# EAGLE schematic TP-34 (EAGLE 6.6.0)

## Sheet 1 of 4
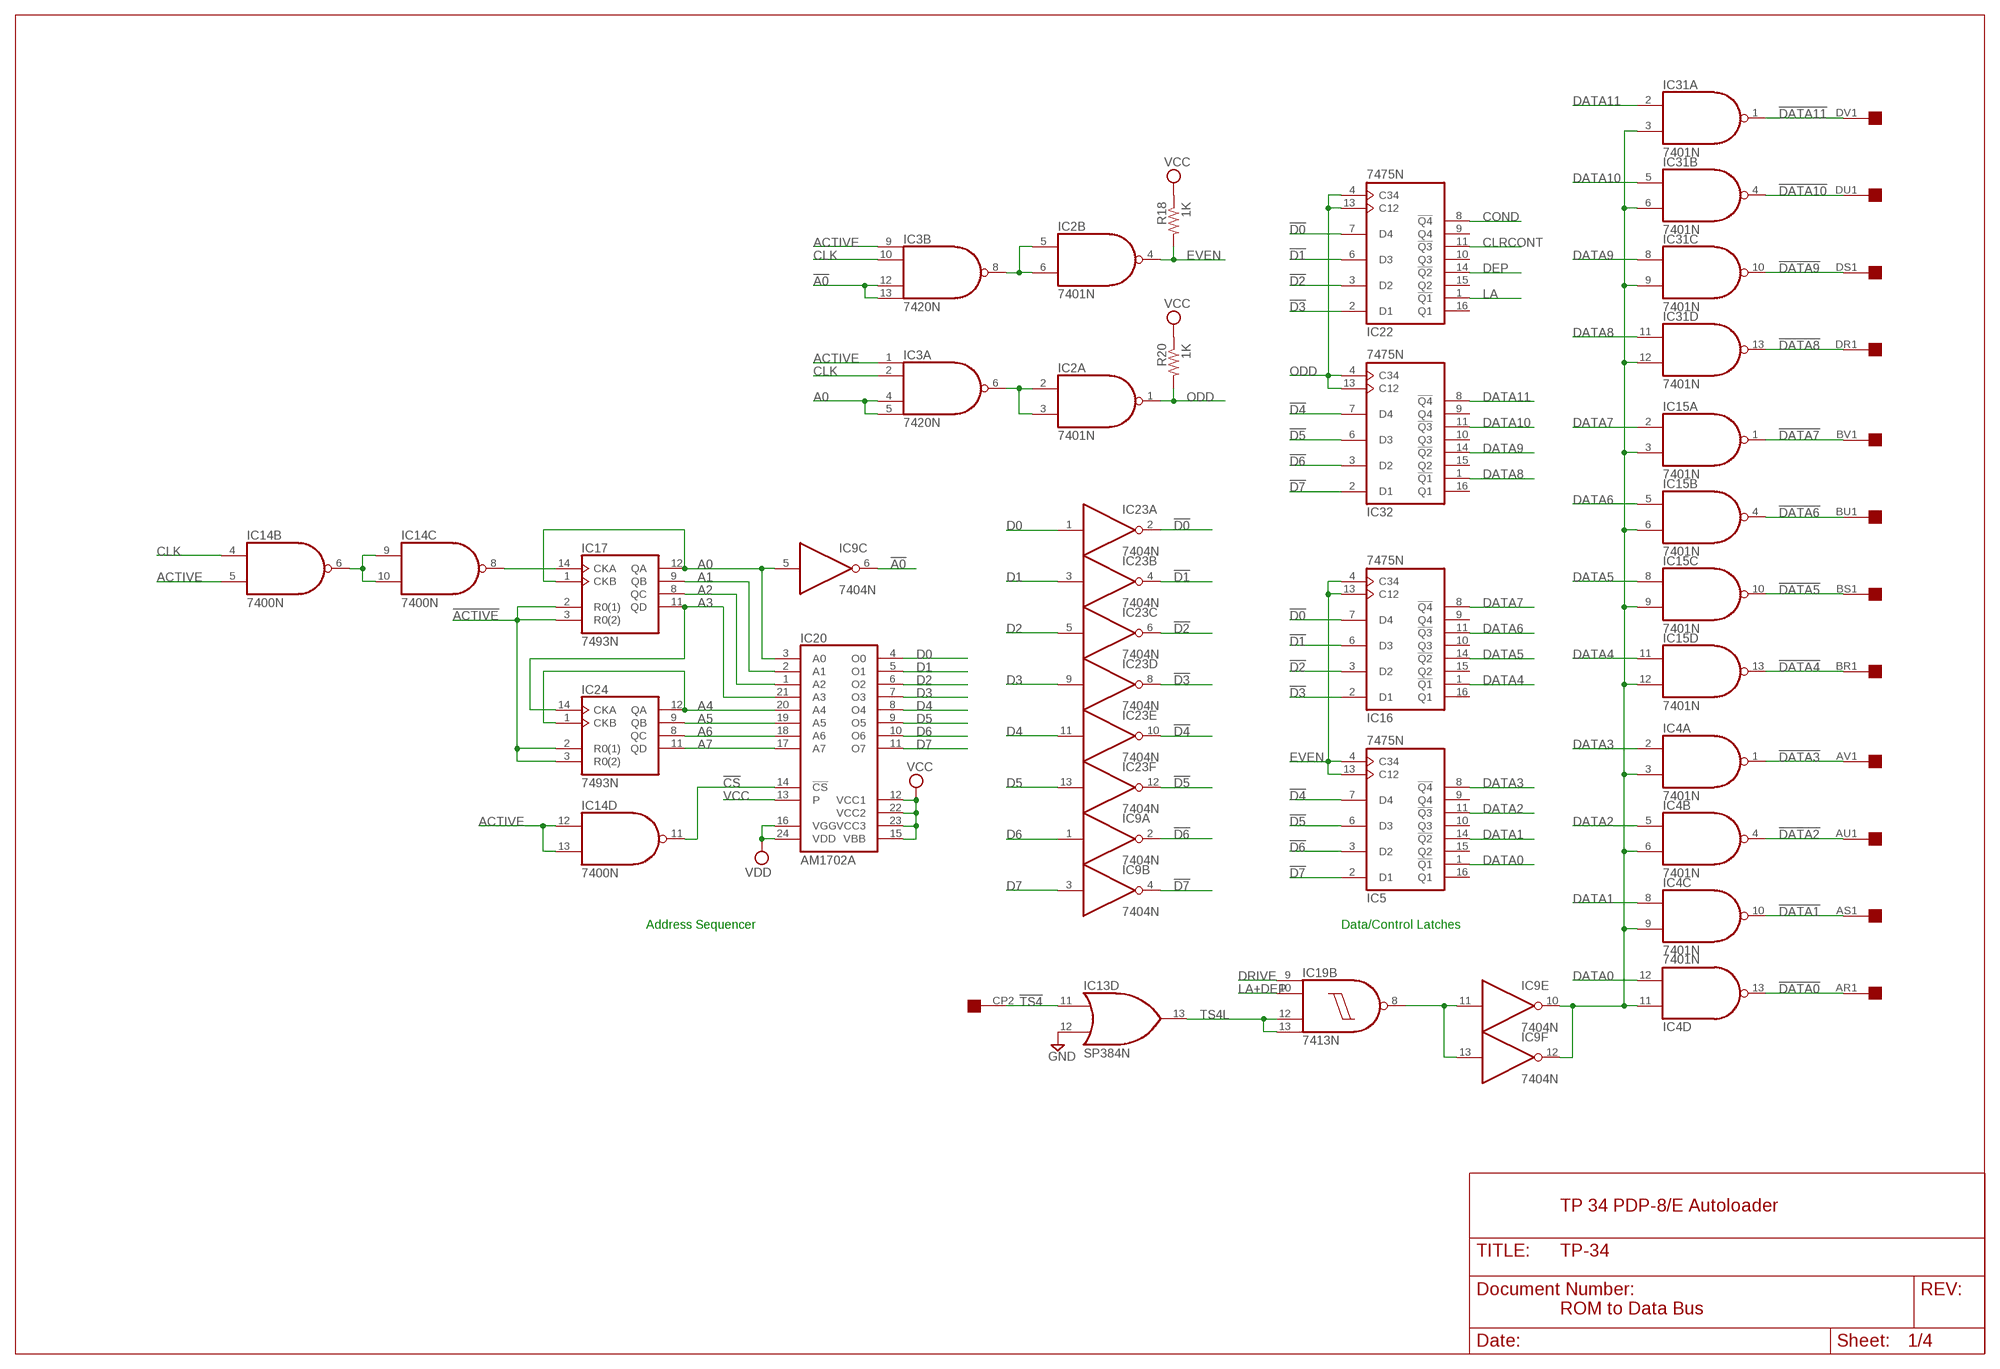
[diagram p0: schematic, sheet 1]

### Parts
IC2  7401N  74LS01N  [DIL14]
IC3  7420N  74S20N  [DIL14]
IC4  7401N  74LS01N  [DIL14]
IC5  7475N  [DIL16]
IC9  7404N  [DIL14]
IC13  SP384N  [DIL14]
IC14  7400N  [DIL14]
IC15  7401N  74LS01N  [DIL14]
IC16  7475N  [DIL16]
IC17  7493N  74LS93N  [DIL14]
IC19  7413N  [DIL14]
IC20  AM1702A  AM1702  [DIL24]
IC22  7475N  [DIL16]
IC23  7404N  [DIL14]
IC24  7493N  74LS93N  [DIL14]
IC31  7401N  74LS01N  [DIL14]
IC32  7475N  [DIL16]
R18  1K  R-US_0207/10  [0207/10]
R20  1K  R-US_0207/10  [0207/10]
U$2  QUAD  [EDGE-CON8]

### Nets
!A0: IC3.12(B:I2) IC3.13(B:I3) IC9.6(C:O)
!ACTIVE: IC17.2(R0(1)) IC17.3(R0(2)) IC24.2(R0(1)) IC24.3(R0(2)) ; also sheet 2
!CS: IC14.11(D:O) IC20.14(!CS)
!D0: IC16.7(D4) IC22.7(D4) IC23.2(A:O)
!D1: IC16.6(D3) IC22.6(D3) IC23.4(B:O)
!D2: IC16.3(D2) IC22.3(D2) IC23.6(C:O)
!D3: IC16.2(D1) IC22.2(D1) IC23.8(D:O)
!D4: IC5.7(D4) IC23.10(E:O) IC32.7(D4)
!D5: IC5.6(D3) IC23.12(F:O) IC32.6(D3)
!D6: IC5.3(D2) IC9.2(A:O) IC32.3(D2)
!D7: IC5.2(D1) IC9.4(B:O) IC32.2(D1)
!DATA0: IC4.13(D:O) U$2.AR1
!DATA1: IC4.10(C:O) U$2.AS1
!DATA2: IC4.4(B:O) U$2.AU1
!DATA3: IC4.1(A:O) U$2.AV1
!DATA4: IC15.13(D:O) U$2.BR1
!DATA5: IC15.10(C:O) U$2.BS1
!DATA6: IC15.4(B:O) U$2.BU1
!DATA7: IC15.1(A:O) U$2.BV1
!DATA8: IC31.13(D:O) U$2.DR1
!DATA9: IC31.10(C:O) U$2.DS1
!DATA10: IC31.4(B:O) U$2.DU1
!DATA11: IC31.1(A:O) U$2.DV1
!TS4: IC13.11(D:I0) U$2.CP2
A0: IC3.4(A:I2) IC3.5(A:I3) IC9.5(C:I) IC17.1(CKB) IC17.12(QA) IC20.3(A0)
A1: IC17.9(QB) IC20.2(A1)
A2: IC17.8(QC) IC20.1(A2)
A3: IC17.11(QD) IC20.21(A3) IC24.14(CKA)
A4: IC20.20(A4) IC24.1(CKB) IC24.12(QA)
A5: IC20.19(A5) IC24.9(QB)
A6: IC20.18(A6) IC24.8(QC)
A7: IC20.17(A7) IC24.11(QD)
ACTIVE: IC3.1(A:I0) IC3.9(B:I0) IC14.5(B:I1) IC14.12(D:I0) IC14.13(D:I1) ; also sheet 2
CLK: IC3.2(A:I1) IC3.10(B:I1) IC14.4(B:I0) ; also sheet 2
CLRCONT: IC22.11(!Q3) ; also sheet 2
COND: IC22.8(!Q4) ; also sheet 2
D0: IC20.4(O0) IC23.1(A:I)
D1: IC20.5(O1) IC23.3(B:I)
D2: IC20.6(O2) IC23.5(C:I)
D3: IC20.7(O3) IC23.9(D:I)
D4: IC20.8(O4) IC23.11(E:I)
D5: IC20.9(O5) IC23.13(F:I)
D6: IC9.1(A:I) IC20.10(O6)
D7: IC9.3(B:I) IC20.11(O7)
DATA0: IC4.12(D:I1) IC5.1(!Q1)
DATA1: IC4.8(C:I0) IC5.14(!Q2)
DATA2: IC4.5(B:I0) IC5.11(!Q3)
DATA3: IC4.2(A:I0) IC5.8(!Q4)
DATA4: IC15.11(D:I0) IC16.1(!Q1)
DATA5: IC15.8(C:I0) IC16.14(!Q2)
DATA6: IC15.5(B:I0) IC16.11(!Q3)
DATA7: IC15.2(A:I0) IC16.8(!Q4)
DATA8: IC31.11(D:I0) IC32.1(!Q1)
DATA9: IC31.8(C:I0) IC32.14(!Q2)
DATA10: IC31.5(B:I0) IC32.11(!Q3)
DATA11: IC31.2(A:I0) IC32.8(!Q4)
DEP: IC22.14(!Q2) ; also sheet 2
DRIVE: IC19.9(B:I0) ; also sheet 3
EVEN: IC2.4(B:O) IC5.4(C34) IC5.13(C12) IC16.4(C34) IC16.13(C12) R18.2
GND [supply]: IC13.12(D:I1) ; also sheet 2,3
LA: IC22.1(!Q1) ; also sheet 2
LA+DEP: IC19.10(B:I1) ; also sheet 3
N$7: IC2.2(A:I0) IC2.3(A:I1) IC3.6(A:O)
N$9: IC2.5(B:I0) IC2.6(B:I1) IC3.8(B:O)
N$20: IC4.3(A:I1) IC4.6(B:I1) IC4.9(C:I1) IC4.11(D:I0) IC9.10(E:O) IC9.12(F:O) IC15.3(A:I1) IC15.6(B:I1) IC15.9(C:I1) IC15.12(D:I1) IC31.3(A:I1) IC31.6(B:I1) IC31.9(C:I1) IC31.12(D:I1)
N$99: IC9.11(E:I) IC9.13(F:I) IC19.8(B:O)
N$163: IC14.6(B:O) IC14.9(C:I0) IC14.10(C:I1)
N$167: IC14.8(C:O) IC17.14(CKA)
ODD: IC2.1(A:O) IC22.4(C34) IC22.13(C12) IC32.4(C34) IC32.13(C12) R20.2 ; also sheet 2
TS4L: IC13.13(D:O) IC19.12(B:I2) IC19.13(B:I3)
VCC [supply]: IC20.12(VCC1) IC20.13(P) IC20.15(VBB) IC20.22(VCC2) IC20.23(VCC3) R18.1 R20.1 ; also sheet 2,3
VDD: IC20.16(VGG) IC20.24(VDD) ; also sheet 2
Unconnected: IC5.9(Q4) IC5.10(Q3) IC5.15(Q2) IC5.16(Q1) IC13.9(C:I0) IC13.10(C:I1) IC13.14(C:O) IC16.9(Q4) IC16.10(Q3) IC16.15(Q2) IC16.16(Q1) IC22.9(Q4) IC22.10(Q3) IC22.15(Q2) IC22.16(Q1) IC32.9(Q4) IC32.10(Q3) IC32.15(Q2) IC32.16(Q1) U$2.AA1 U$2.AB1 U$2.AC1 U$2.AD1 U$2.AD2 U$2.AE1 U$2.AE2 U$2.AH1 U$2.AH2 U$2.AJ1 U$2.AK1 U$2.AL1 U$2.AL2 U$2.AM1 U$2.AM2 U$2.AN2 U$2.AP1 U$2.AP2 U$2.AR2 U$2.AS2 U$2.AT1 U$2.AT2 U$2.AU2 U$2.AV2 U$2.BA1 U$2.BB1 U$2.BB2 U$2.BC1 U$2.BD1 U$2.BD2 U$2.BE1 U$2.BE2 U$2.BH1 U$2.BH2 U$2.BJ1 U$2.BJ2 U$2.BK1 U$2.BL1 U$2.BL2 U$2.BM1 U$2.BN2 U$2.BP1 U$2.BP2 U$2.BR2 U$2.BS2 U$2.BT1 U$2.BT2 U$2.BV2 U$2.CA1 U$2.CB1 U$2.CB2 U$2.CC1 U$2.CD1 U$2.CD2 U$2.CE1 U$2.CE2 U$2.CF1 U$2.CH1 U$2.CH2 U$2.CJ1 U$2.CK1 U$2.CK2 U$2.CL1 U$2.CL2 U$2.CM1 U$2.CM2 U$2.CN1 U$2.CN2 U$2.CP1 U$2.CR2 U$2.CS1 U$2.CS2 U$2.CT1 U$2.CU1 U$2.CU2 U$2.CV2 U$2.DA1 U$2.DA2 U$2.DB1 U$2.DC1 U$2.DC2 U$2.DD1 U$2.DD2 U$2.DE1 U$2.DE2 U$2.DH1 U$2.DH2 U$2.DJ1 U$2.DJ2 U$2.DK1 U$2.DK2 U$2.DL1 U$2.DL2 U$2.DM1 U$2.DM2 U$2.DP1 U$2.DP2 U$2.DT1 U$2.DT2

### Notes on the sheet
- Address Sequencer | Data/Control Latches
- TP 34 PDP-8/E Autoloader
- ROM to Data Bus

## Sheet 2 of 4
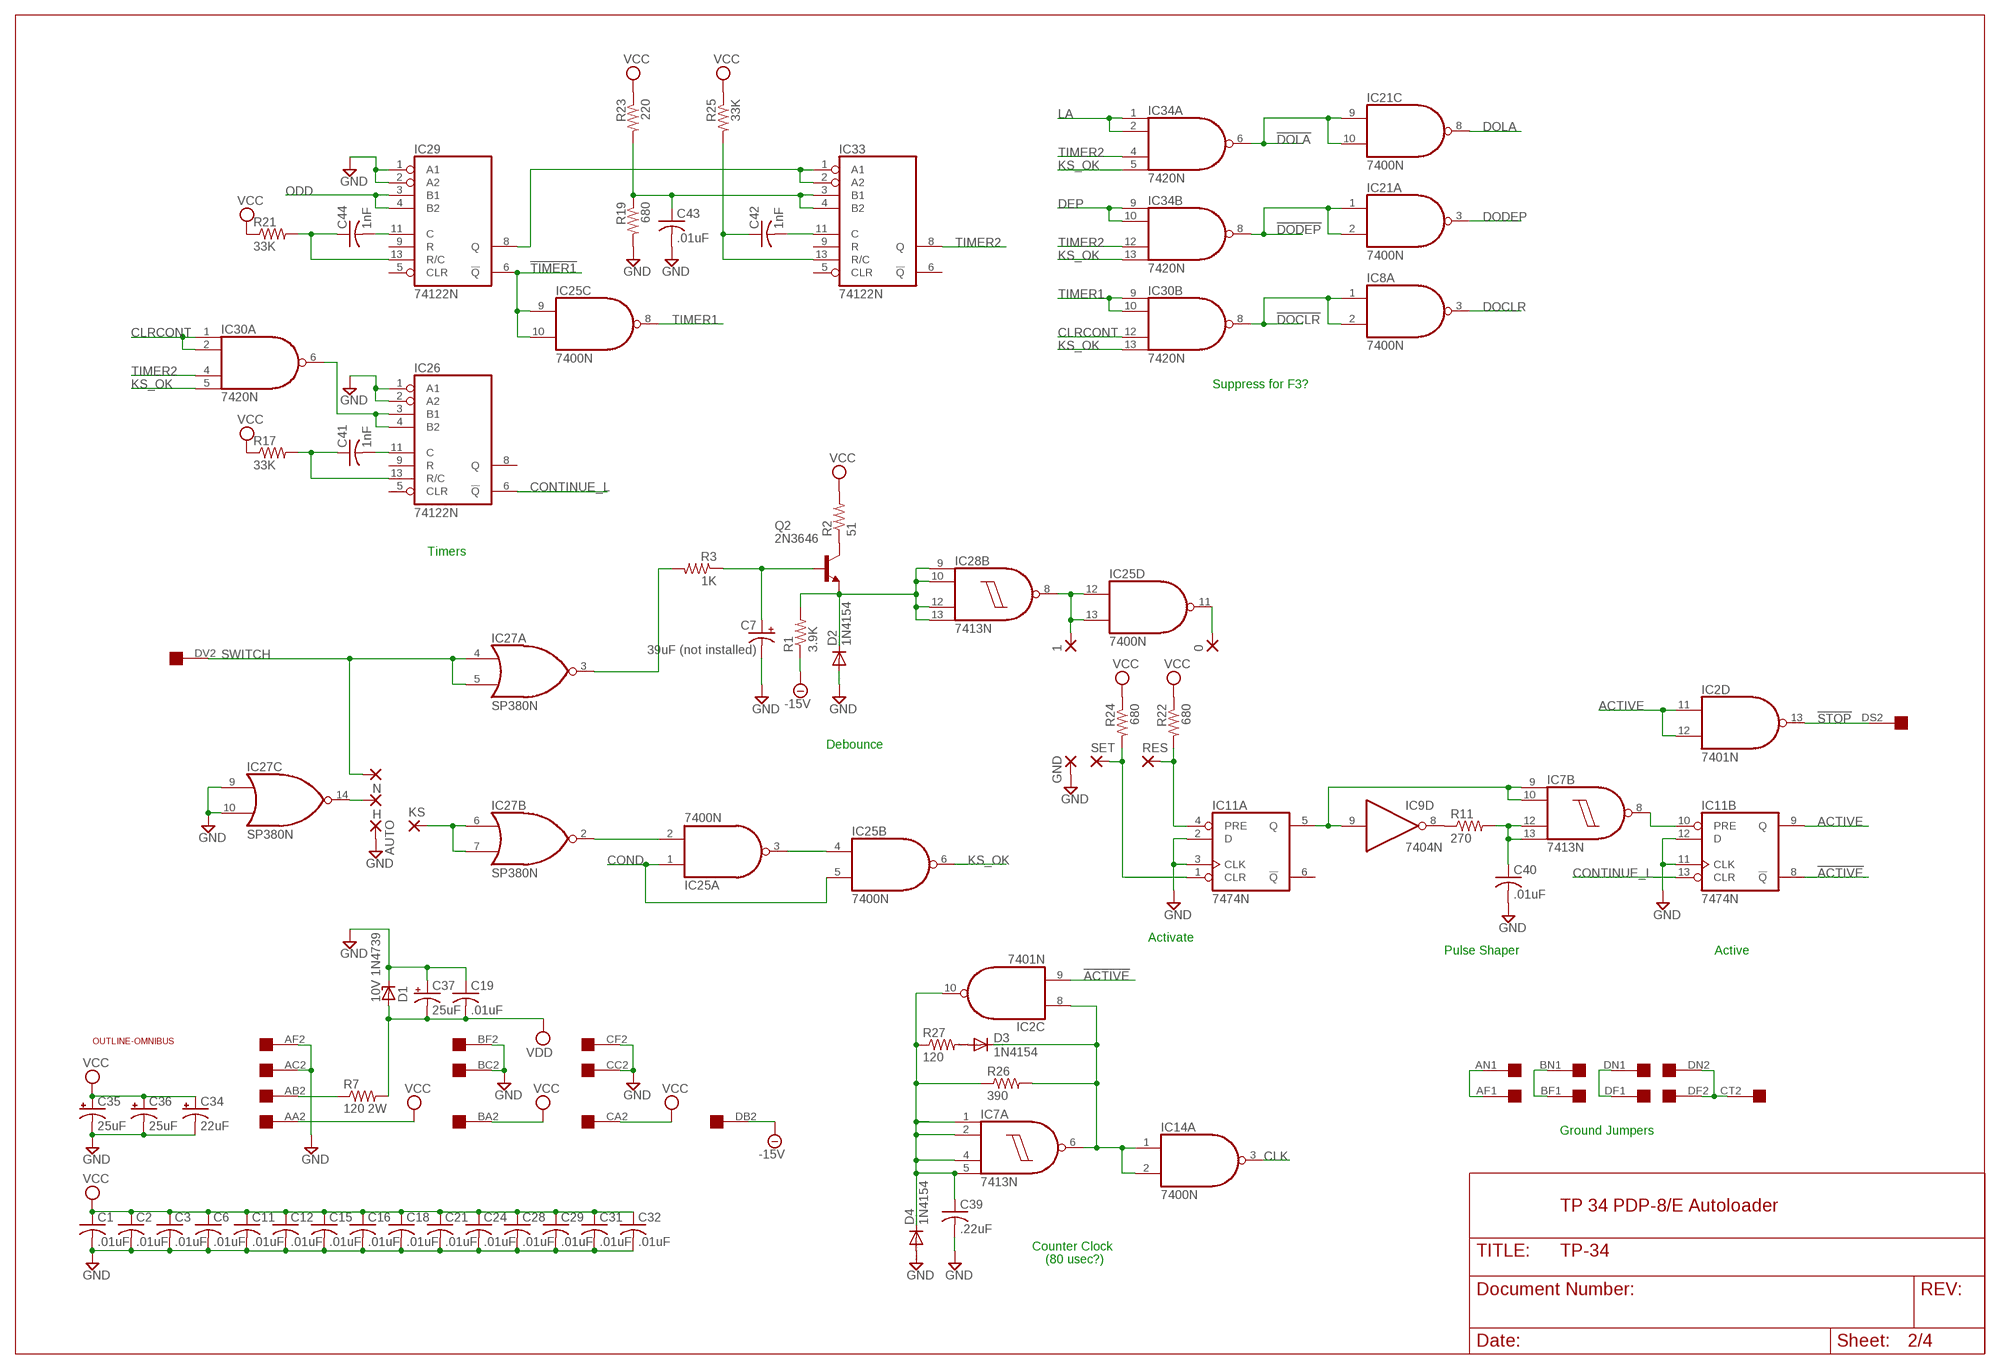
[diagram p1: schematic, sheet 2]

### Parts
0  1,6/0,8  [1,6/0,8]
1  1,6/0,8  [1,6/0,8]
AUTO  1,6/0,8  [1,6/0,8]
C1  .01uF  C-US075-032X103  [C075-032X103]
C2  .01uF  C-US075-032X103  [C075-032X103]
C3  .01uF  C-US075-032X103  [C075-032X103]
C6  .01uF  C-US075-032X103  [C075-032X103]
C7  39uF (not installed)  CPOL-USE15-5AXIAL  [E15-5]
C11  .01uF  C-US075-032X103  [C075-032X103]
C12  .01uF  C-US075-032X103  [C075-032X103]
C15  .01uF  C-US075-032X103  [C075-032X103]
C16  .01uF  C-US075-032X103  [C075-032X103]
C18  .01uF  C-US075-032X103  [C075-032X103]
C19  .01uF  C-US075-032X103  [C075-032X103]
C21  .01uF  C-US075-032X103  [C075-032X103]
C24  .01uF  C-US075-032X103  [C075-032X103]
C28  .01uF  C-US075-032X103  [C075-032X103]
C29  .01uF  C-US075-032X103  [C075-032X103]
C31  .01uF  C-US075-032X103  [C075-032X103]
C32  .01uF  C-US075-032X103  [C075-032X103]
C34  22uF  CPOL-USE20-8AXIAL  [E12-8]
C35  25uF  CPOL-USE15-5AXIAL  [E15-5]
C36  25uF  CPOL-USE15-5AXIAL  [E15-5]
C37  25uF  CPOL-USE15-5AXIAL  [E15-5]
C39  .22uF  C-US075-032X103  [C075-032X103]
C40  .01uF  C-US075-032X103  [C075-032X103]
C41  1nF  C-US075-032X103  [C075-032X103]
C42  1nF  C-US075-032X103  [C075-032X103]
C43  .01uF  C-US075-032X103  [C075-032X103]
C44  1nF  C-US075-032X103  [C075-032X103]
D1  10V 1N4739  ZENER-DIODEC1702-15  [C1702-15]
D2  1N4154  1N4148DO35-10  [DO35-10]
D3  1N4154  1N4148DO35-10  [DO35-10]
D4  1N4154  1N4148DO35-10  [DO35-10]
GND  1,6/0,8  [1,6/0,8]
H  1,6/0,8  [1,6/0,8]
IC7  7413N  [DIL14]
IC8  7400N  [DIL14]
IC11  7474N  74S74N  [DIL14]
IC21  7400N  [DIL14]
IC25  7400N  [DIL14]
IC26  74122N  74LS122N  [DIL14]
IC27  SP380N  [DIL14]
IC28  7413N  [DIL14]
IC29  74122N  74LS122N  [DIL14]
IC30  7420N  74S20N  [DIL14]
IC33  74122N  74LS122N  [DIL14]
IC34  7420N  74S20N  [DIL14]
KS  1,6/0,8  [1,6/0,8]
N  1,6/0,8  [1,6/0,8]
Q2  2N3646  2N2102  [TO5]
R1  3.9K  R-US_0207/10  [0207/10]
R2  51  R-US_0207/10  [0207/10]
R3  1K  R-US_0207/10  [0207/10]
R7  120 2W  R-US_0414/15  [0414/15]
R11  270  R-US_0207/12  [0207/12]
R17  33K  R-US_0207/10  [0207/10]
R19  680  R-US_0207/10  [0207/10]
R21  33K  R-US_0207/10  [0207/10]
R22  680  R-US_0207/10  [0207/10]
R23  220  R-US_0207/10  [0207/10]
R24  680  R-US_0207/10  [0207/10]
R25  33K  R-US_0207/10  [0207/10]
R26  390  R-US_0207/10  [0207/10]
R27  120  R-US_0207/10  [0207/10]
RES  1,6/0,8  [1,6/0,8]
SET  1,6/0,8  [1,6/0,8]
U$1  OUTLINE-OMNIBUS  [OMNIBUS]

### Nets
!ACTIVE: IC2.9(C:I1) IC11.8(B:!Q) ; also sheet 1
!DOCLR: IC8.1(A:I0) IC8.2(A:I1) IC30.8(B:O) ; also sheet 3
!DODEP: IC21.1(A:I0) IC21.2(A:I1) IC34.8(B:O) ; also sheet 3
!DOLA: IC21.9(C:I0) IC21.10(C:I1) IC34.6(A:O) ; also sheet 3
!STOP: IC2.13(D:O) U$2.DS2
!TIMER1: IC25.9(C:I0) IC25.10(C:I1) IC29.6(!Q)
-15V: R1.1 U$2.DB2
ACTIVE: IC2.11(D:I0) IC2.12(D:I1) IC11.9(B:Q) ; also sheet 1
CLK: IC14.3(A:O) ; also sheet 1
CLRCONT: IC30.1(A:I0) IC30.2(A:I1) IC30.12(B:I2) ; also sheet 1
COND: IC25.1(A:I0) IC25.5(B:I1) ; also sheet 1
CONTINUE_L: IC11.13(B:CLR) IC26.6(!Q) ; also sheet 3
DEP: IC34.9(B:I0) IC34.10(B:I1) ; also sheet 1
DOCLR: IC8.3(A:O) ; also sheet 3
DODEP: IC21.3(A:O) ; also sheet 3
DOLA: IC21.8(C:O) ; also sheet 3
GND [supply]: AUTO.1(P) C1.2 C2.2 C3.2 C6.2 C7.- C11.2 C12.2 C15.2 C16.2 C18.2 C19.1 C21.2 C24.2 C28.2 C29.2 C31.2 C32.2 C34.- C35.- C36.- C37.+ C39.2 C40.2 C43.2 D1.C D2.A D4.A GND.1(P) IC11.2(A:D) IC11.3(A:CLK) IC11.11(B:CLK) IC11.12(B:D) IC26.1(A1) IC26.2(A2) IC27.9(C:I0) IC27.10(C:I1) IC29.1(A1) IC29.2(A2) R19.2 U$2.AC2 U$2.AF2 U$2.BC2 U$2.BF2 U$2.CC2 U$2.CF2 ; also sheet 1,3
KS_OK: IC25.6(B:O) IC30.5(A:I3) IC30.13(B:I3) IC34.5(A:I3) IC34.13(B:I3)
LA: IC34.1(A:I0) IC34.2(A:I1) ; also sheet 1
N$1 [supply]: U$2.AF1 U$2.AN1
N$2 [supply]: U$2.BF1 U$2.BN1
N$3 [supply]: U$2.DF1 U$2.DN1
N$4 [supply]: U$2.CT2 U$2.DF2 U$2.DN2
N$6: D2.C IC28.9(B:I0) IC28.10(B:I1) IC28.12(B:I2) IC28.13(B:I3) Q2.1(E) R1.2
N$11: D3.C IC2.8(C:I0) IC7.6(A:O) IC14.1(A:I0) IC14.2(A:I1) R26.2
N$17: D3.A R27.2
N$21: C39.1 D4.C IC2.10(C:O) IC7.1(A:I0) IC7.2(A:I1) IC7.4(A:I2) IC7.5(A:I3) R26.1 R27.1
N$26: IC7.9(B:I0) IC7.10(B:I1) IC9.9(D:I) IC11.5(A:Q)
N$44: 1.1(P) IC25.12(D:I0) IC25.13(D:I1) IC28.8(B:O)
N$49: IC11.4(A:PRE) R22.2 RES.1(P)
N$50: IC11.1(A:CLR) R24.2 SET.1(P)
N$57: 0.1(P) IC25.11(D:O)
N$64: C42.1 IC33.13(R/C) R25.2
N$65: C42.2 IC33.11(C)
N$67: C43.1 IC33.3(B1) IC33.4(B2) R19.1 R23.2
N$74: C44.1 IC29.13(R/C) R21.2
N$75: C40.1 IC7.12(B:I2) IC7.13(B:I3) R11.2
N$84: IC7.8(B:O) IC11.10(B:PRE)
N$85: C44.2 IC29.11(C)
N$107: IC9.8(D:O) R11.1
N$159: C7.+ Q2.2(B) R3.1
N$173: Q2.3(C) R2.1
N$223: C41.1 IC26.13(R/C) R17.2
N$234: C41.2 IC26.11(C)
N$240 [supply]: R7.1 U$2.AB2
N$300: IC25.3(A:O) IC25.4(B:I0)
N$302: IC25.2(A:I1) IC27.2(B:O)
N$315: IC26.3(B1) IC26.4(B2) IC30.6(A:O)
N$325: IC27.6(B:I0) IC27.7(B:I1) KS.1(P)
N$331: H.1(P) IC27.14(C:O)
N$344: IC29.8(Q) IC33.1(A1) IC33.2(A2)
ODD: IC29.3(B1) IC29.4(B2) ; also sheet 1
SWITCH: IC27.4(A:I0) IC27.5(A:I1) N.1(P) U$2.DV2
SWITCHL: IC27.3(A:O) R3.2
TIMER1: IC25.8(C:O) IC30.9(B:I0) IC30.10(B:I1)
TIMER2: IC30.4(A:I2) IC33.8(Q) IC34.4(A:I2) IC34.12(B:I2)
VCC [supply]: C1.1 C2.1 C3.1 C6.1 C11.1 C12.1 C15.1 C16.1 C18.1 C21.1 C24.1 C28.1 C29.1 C31.1 C32.1 C34.+ C35.+ C36.+ R2.2 R17.1 R21.1 R22.1 R23.1 R24.1 R25.1 U$2.AA2 U$2.BA2 U$2.CA2 ; also sheet 1,3
VDD: C19.2 C37.- D1.A R7.2 ; also sheet 1
Unconnected: IC11.6(A:!Q) IC21.11(D:O) IC21.12(D:I0) IC21.13(D:I1) IC26.5(CLR) IC26.8(Q) IC26.9(R) IC27.11(D:I0) IC27.12(D:I1) IC27.13(D:O) IC29.5(CLR) IC29.9(R) IC33.5(CLR) IC33.6(!Q) IC33.9(R)

### Notes on the sheet
- Suppress for F3?
- Timers
- Debounce
- Activate
- Pulse Shaper | Active
- Ground Jumpers
- TP 34 PDP-8/E Autoloader
- Counter Clock
- (80 usec?)

## Sheet 3 of 4
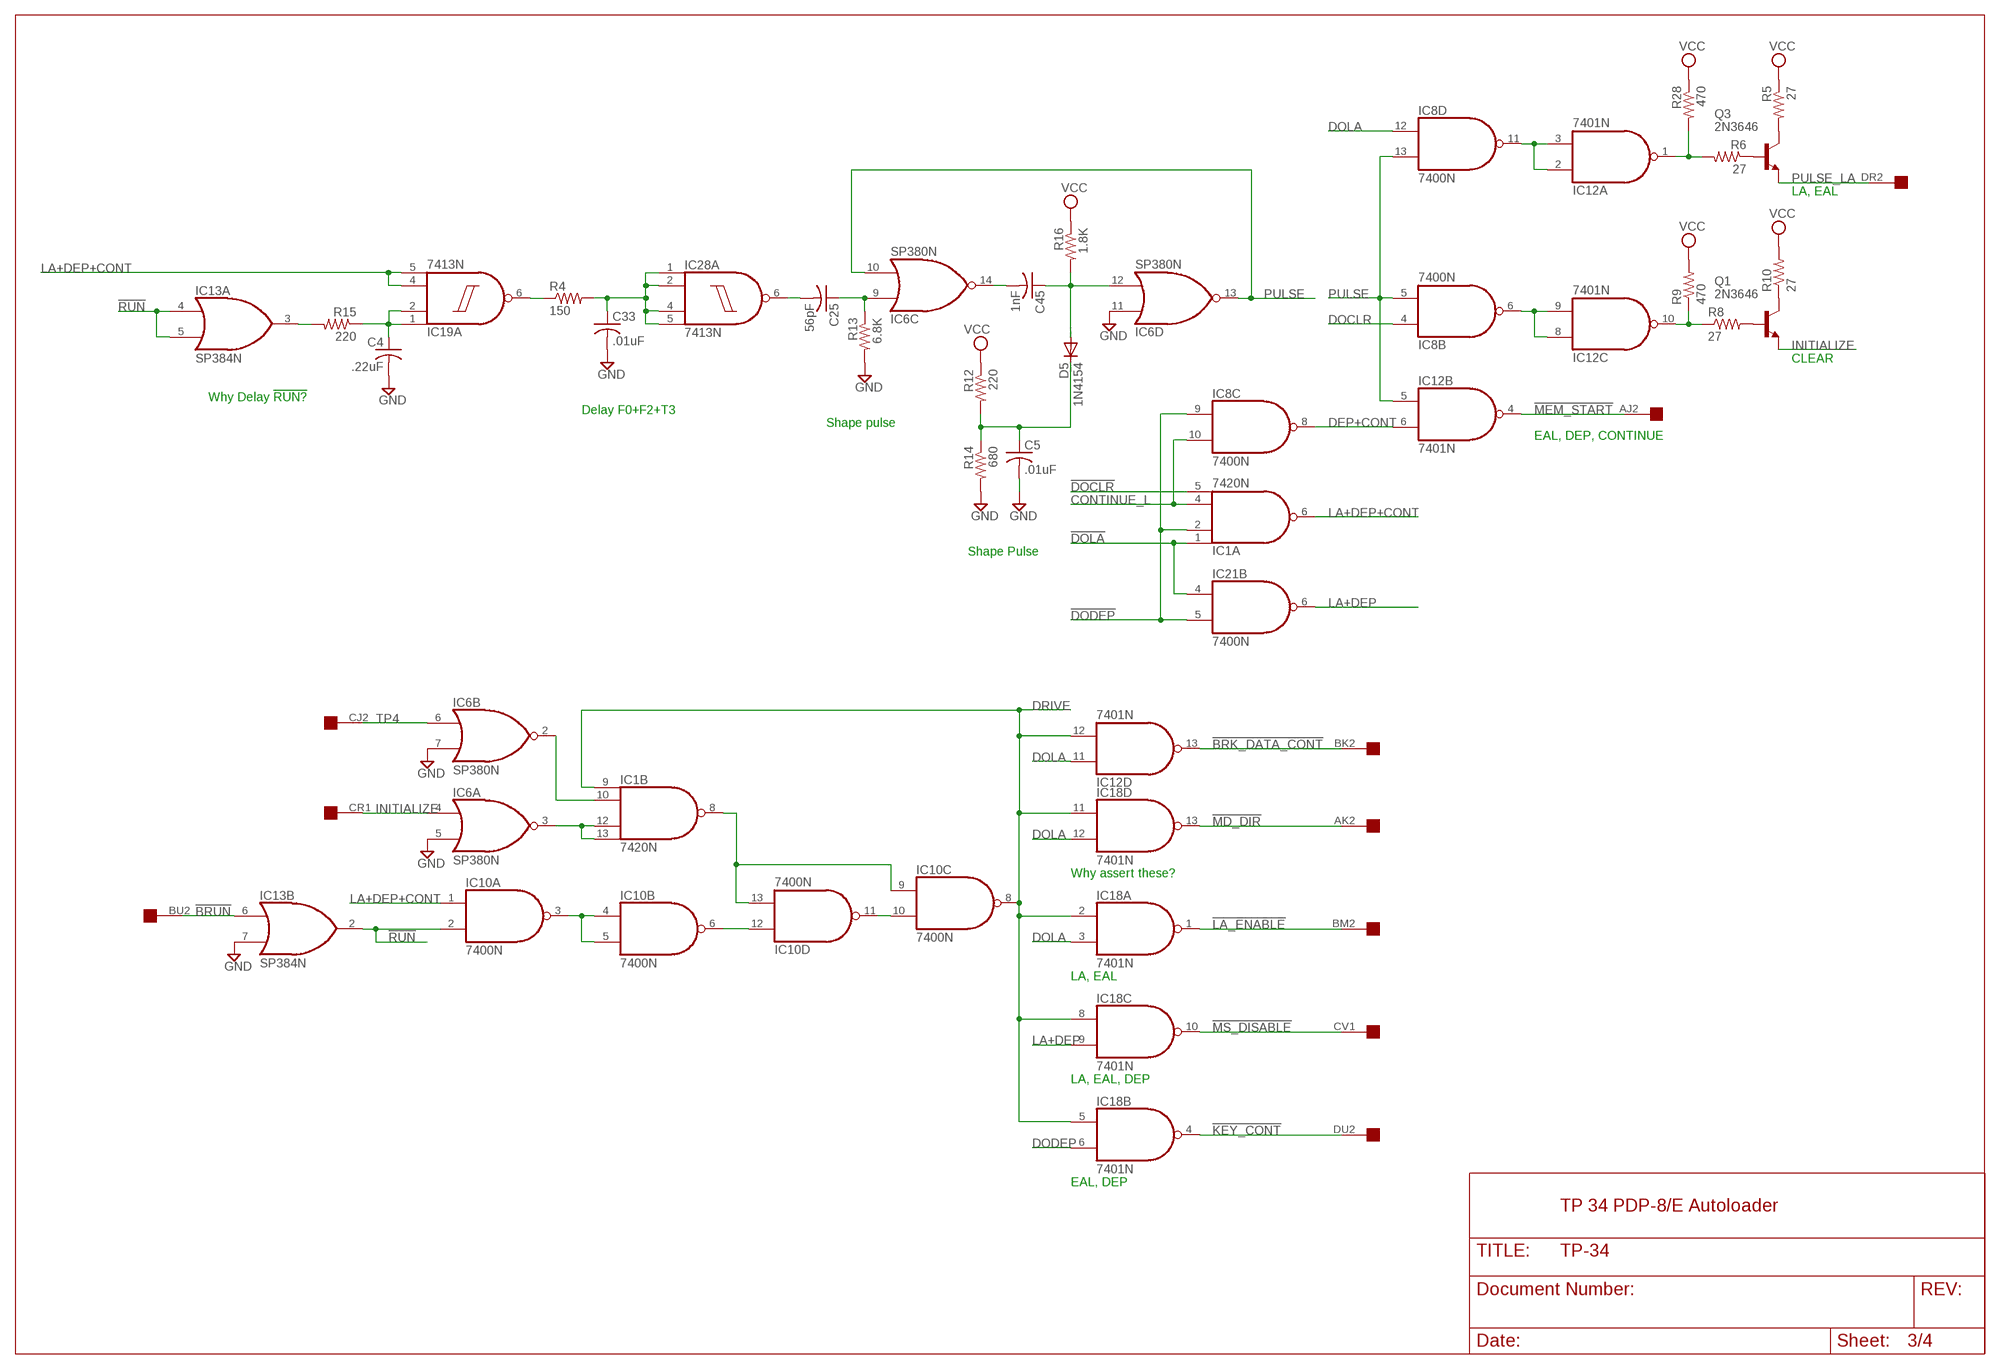
[diagram p2: schematic, sheet 3]

### Parts
C4  .22uF  C-US075-032X103  [C075-032X103]
C5  .01uF  C-US075-032X103  [C075-032X103]
C25  56pF  C-US102-043X133  [C102-043X133]
C33  .01uF  C-US075-032X103  [C075-032X103]
C45  1nF  C-US050-035X075  [C050-035X075]
D5  1N4154  1N4148DO35-10  [DO35-10]
IC1  7420N  74S20N  [DIL14]
IC6  SP380N  [DIL14]
IC10  7400N  [DIL14]
IC12  7401N  74LS01N  [DIL14]
IC18  7401N  74LS01N  [DIL14]
Q1  2N3646  2N2102  [TO5]
Q3  2N3646  2N2102  [TO5]
R4  150  R-US_0207/10  [0207/10]
R5  27  R-US_0207/10  [0207/10]
R6  27  R-US_0207/10  [0207/10]
R8  27  R-US_0207/10  [0207/10]
R9  470  R-US_0207/10  [0207/10]
R10  27  R-US_0207/10  [0207/10]
R12  220  R-US_0207/10  [0207/10]
R13  6.8K  R-US_0207/10  [0207/10]
R14  680  R-US_0207/10  [0207/10]
R15  220  R-US_0207/15  [0207/15]
R16  1.8K  R-US_0207/10  [0207/10]
R28  470  R-US_0207/10  [0207/10]

### Nets
!BRK_DATA_CONT: IC12.13(D:O) U$2.BK2
!BRUN: IC13.6(B:I0) U$2.BU2
!DOCLR: IC1.5(A:I3) ; also sheet 2
!DODEP: IC1.2(A:I1) IC8.9(C:I0) IC21.5(B:I1) ; also sheet 2
!DOLA: IC1.1(A:I0) IC21.4(B:I0) ; also sheet 2
!INITIALIZE: IC1.12(B:I2) IC1.13(B:I3) IC6.3(A:O)
!KEY_CONT: IC18.4(B:O) U$2.DU2
!LA_ENABLE: IC18.1(A:O) U$2.BM2
!MD_DIR: IC18.13(D:O) U$2.AK2
!MEM_START: IC12.4(B:O) U$2.AJ2
!MS_DISABLE: IC18.10(C:O) U$2.CV1
!RUN: IC10.2(A:I1) IC13.2(B:O) IC13.4(A:I0) IC13.5(A:I1)
!TP4: IC1.10(B:I1) IC6.2(B:O)
BRUNL: IC13.3(A:O) R15.2
CONTINUE_L: IC1.4(A:I2) IC8.10(C:I1) ; also sheet 2
DEP+CONT: IC8.8(C:O) IC12.6(B:I1)
DOCLR: IC8.4(B:I0) ; also sheet 2
DODEP: IC18.6(B:I1) ; also sheet 2
DOLA: IC8.12(D:I0) IC12.11(D:I0) IC18.3(A:I1) IC18.12(D:I1) ; also sheet 2
DRIVE: IC1.9(B:I0) IC10.8(C:O) IC12.12(D:I1) IC18.2(A:I0) IC18.5(B:I0) IC18.8(C:I0) IC18.11(D:I0) ; also sheet 1
GND [supply]: C4.2 C5.2 C33.2 IC6.5(A:I1) IC6.7(B:I1) IC6.11(D:I0) IC13.7(B:I1) R13.2 R14.2 ; also sheet 1,2
INITIALIZE: IC6.4(A:I0) Q1.1(E) U$2.CR1
LA+DEP: IC18.9(C:I1) IC21.6(B:O) ; also sheet 1
LA+DEP+CONT: IC1.6(A:O) IC10.1(A:I0) IC19.4(A:I2) IC19.5(A:I3)
N$5: IC10.6(B:O) IC10.12(D:I0)
N$14: C25.2 IC28.6(A:O)
N$22: C25.1 IC6.9(C:I0) R13.1
N$23: C45.1 D5.A IC6.12(D:I1) R16.2
N$24: C5.1 D5.C R12.2 R14.1
N$28: C45.2 IC6.14(C:O)
N$38: IC1.8(B:O) IC10.9(C:I0) IC10.13(D:I1)
N$94: IC8.11(D:O) IC12.2(A:I0) IC12.3(A:I1)
N$96: IC8.6(B:O) IC12.8(C:I0) IC12.9(C:I1)
N$110: IC10.3(A:O) IC10.4(B:I0) IC10.5(B:I1)
N$116: IC10.10(C:I1) IC10.11(D:O)
N$134: IC12.1(A:O) R6.2 R28.2
N$143: IC12.10(C:O) R8.1 R9.1
N$169: Q1.3(C) R10.1
N$171: Q1.2(B) R8.2
N$205: C4.1 IC19.1(A:I0) IC19.2(A:I1) R15.1
N$222: IC19.6(A:O) R4.1
N$231: C33.1 IC28.1(A:I0) IC28.2(A:I1) IC28.4(A:I2) IC28.5(A:I3) R4.2
N$237: Q3.3(C) R5.2
N$238: Q3.2(B) R6.1
PULSE: IC6.10(C:I1) IC6.13(D:O) IC8.5(B:I1) IC8.13(D:I1) IC12.5(B:I0)
PULSE_LA: Q3.1(E) U$2.DR2
TP4: IC6.6(B:I0) U$2.CJ2
VCC [supply]: R5.1 R9.2 R10.2 R12.1 R16.1 R28.1 ; also sheet 1,2

### Notes on the sheet
- LA, EAL
- CLEAR
- Why Delay !RUN?
- Delay F0+F2+T3
- Shape pulse
- EAL, DEP, CONTINUE
- Shape Pulse
- Why assert these?
- LA, EAL
- LA, EAL, DEP
- EAL, DEP
- TP 34 PDP-8/E Autoloader

## Sheet 4 of 4
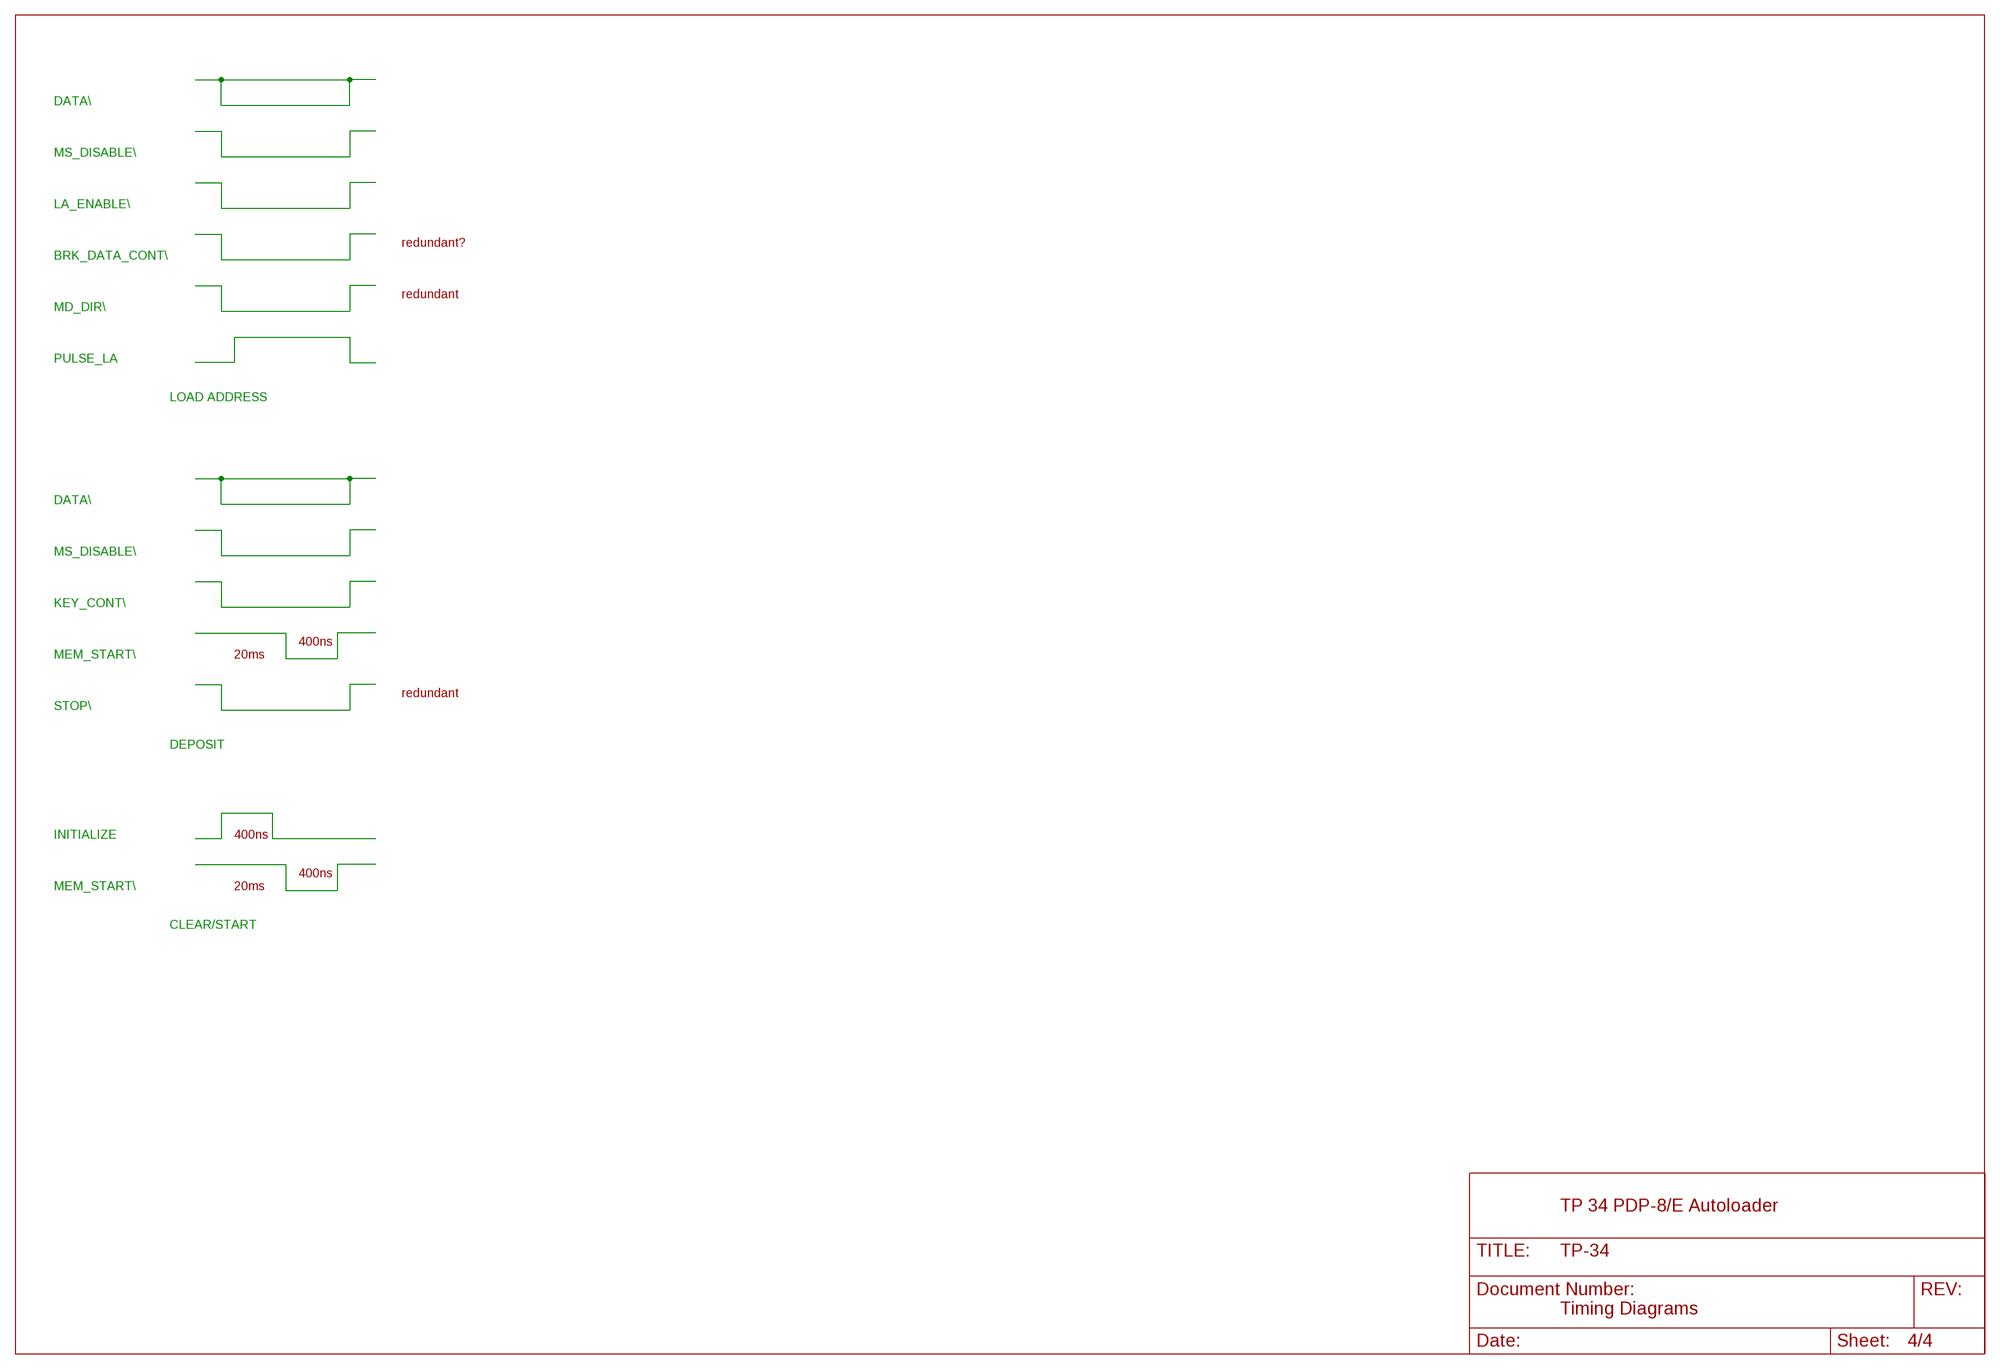
[diagram p3: schematic, sheet 4]

### Notes on the sheet
- DATA\\
- MS_DISABLE\\
- LA_ENABLE\\
- redundant?
- BRK_DATA_CONT\\
- redundant
- MD_DIR\\
- PULSE_LA
- LOAD ADDRESS
- DATA\\
- MS_DISABLE\\
- KEY_CONT\\
- 400ns
- MEM_START\\ | 20ms
- redundant
- STOP\\
- DEPOSIT
- INITIALIZE | 400ns
- 400ns
- MEM_START\\ | 20ms
- CLEAR/START
- TP 34 PDP-8/E Autoloader
- Timing Diagrams

## Power pins joined to a net without a drawn wire
GND: IC1.7(P:GND) IC2.7(P:GND) IC3.7(P:GND) IC4.7(P:GND) IC5.12(GND) IC6.1(P:GND) IC7.7(P:GND) IC8.7(P:GND) IC9.7(P:GND) IC10.7(P:GND) IC11.7(P:GND) IC12.7(P:GND) IC13.1(GND) IC14.7(P:GND) IC15.7(P:GND) IC16.12(GND) IC17.10(GND) IC18.7(P:GND) IC19.7(P:GND) IC21.7(P:GND) IC22.12(GND) IC23.7(P:GND) IC24.10(GND) IC25.7(P:GND) IC26.7(GND) IC27.1(P:GND) IC28.7(P:GND) IC29.7(GND) IC30.7(P:GND) IC31.7(P:GND) IC32.12(GND) IC33.7(GND) IC34.7(P:GND)
VCC: IC1.14(P:VCC) IC2.14(P:VCC) IC3.14(P:VCC) IC4.14(P:VCC) IC5.5(VCC) IC6.8(P:VCC) IC7.14(P:VCC) IC8.14(P:VCC) IC9.14(P:VCC) IC10.14(P:VCC) IC11.14(P:VCC) IC12.14(P:VCC) IC13.8(VCC) IC14.14(P:VCC) IC15.14(P:VCC) IC16.5(VCC) IC17.5(VCC) IC18.14(P:VCC) IC19.14(P:VCC) IC21.14(P:VCC) IC22.5(VCC) IC23.14(P:VCC) IC24.5(VCC) IC25.14(P:VCC) IC26.14(VCC) IC27.8(P:VCC) IC28.14(P:VCC) IC29.14(VCC) IC30.14(P:VCC) IC31.14(P:VCC) IC32.5(VCC) IC33.14(VCC) IC34.14(P:VCC)

## Library data of the parts
0 1 AUTO GND H KS N RES SET = wirepad:1,6/0,8: THROUGH-HOLE PAD
C1-C6 C11 C12 C15 C16 C18 C19 C21 C24 C25 C28 C29 C31-C33 C39-C45 = rcl:C-US: CAPACITOR, American symbol
C7 C35-C37 = rcl:CPOL-US: POLARIZED CAPACITOR, American symbol
C34 = dec-con:CPOL-USE20-8AXIAL: A 0.8 inch electrolytic.
D1 = diode:ZENER-DIODE: Z-Diode
D2-D5 = diode:1N4148: DIODE high speed (Philips)
IC1 IC3 IC30 IC34 = 74xx-us:74*20: Dual 4-input NAND gate
IC2 IC4 IC12 IC15 IC18 IC31 = 74xx-us:74*01: Quad 2-input NAND gate, open collector
IC5 IC16 IC22 IC32 = 74xx-us:74*75: 4-bit bistable LATCH
IC6 IC27 = dec-con:SP380: Quad NOR gate (use 8640)
IC7 IC19 IC28 = 74xx-us:74*13: Dual 4-input NAND schmitt trigger
IC8 IC10 IC14 IC21 IC25 = 74xx-us:74*00: Quad 2-input NAND gate
IC9 IC23 = 74xx-us:74*04: Hex INVERTER
IC11 = 74xx-us:74*74: Dual D type positive edge triggered FLIP FLOP, preset and clear
IC13 = dec-con:SP384: Quad OR gate
IC17 IC24 = 74xx-us:74*93: Decade, divide by twelve and binary COUNTER
IC20 = dec-con:AM1702: 256x8 EPROM
IC26 IC29 IC33 = 74xx-us:74*122: Retriggerable monostable MULTIVIBRATOR
Q1-Q3 = transistor-npn:2N2102: NPN Transistor
R1-R28 = rcl:R-US_: RESISTOR, American symbol
U$1 = dec-con:OUTLINE-*: Board outlines for DEC boards.
U$2 = dec-con:QUAD: Quad-Height DEC board

## Net classes
1 supply: width 0.813 mm